# EasyEDA schematic BIT 5.json
TITLE: TRICORE | ALU | LOGIC; REV: 1.0; Date: 2022-01-06; Sheet: 7/9; Drawn By: Koehler, Paul; Company: komed3
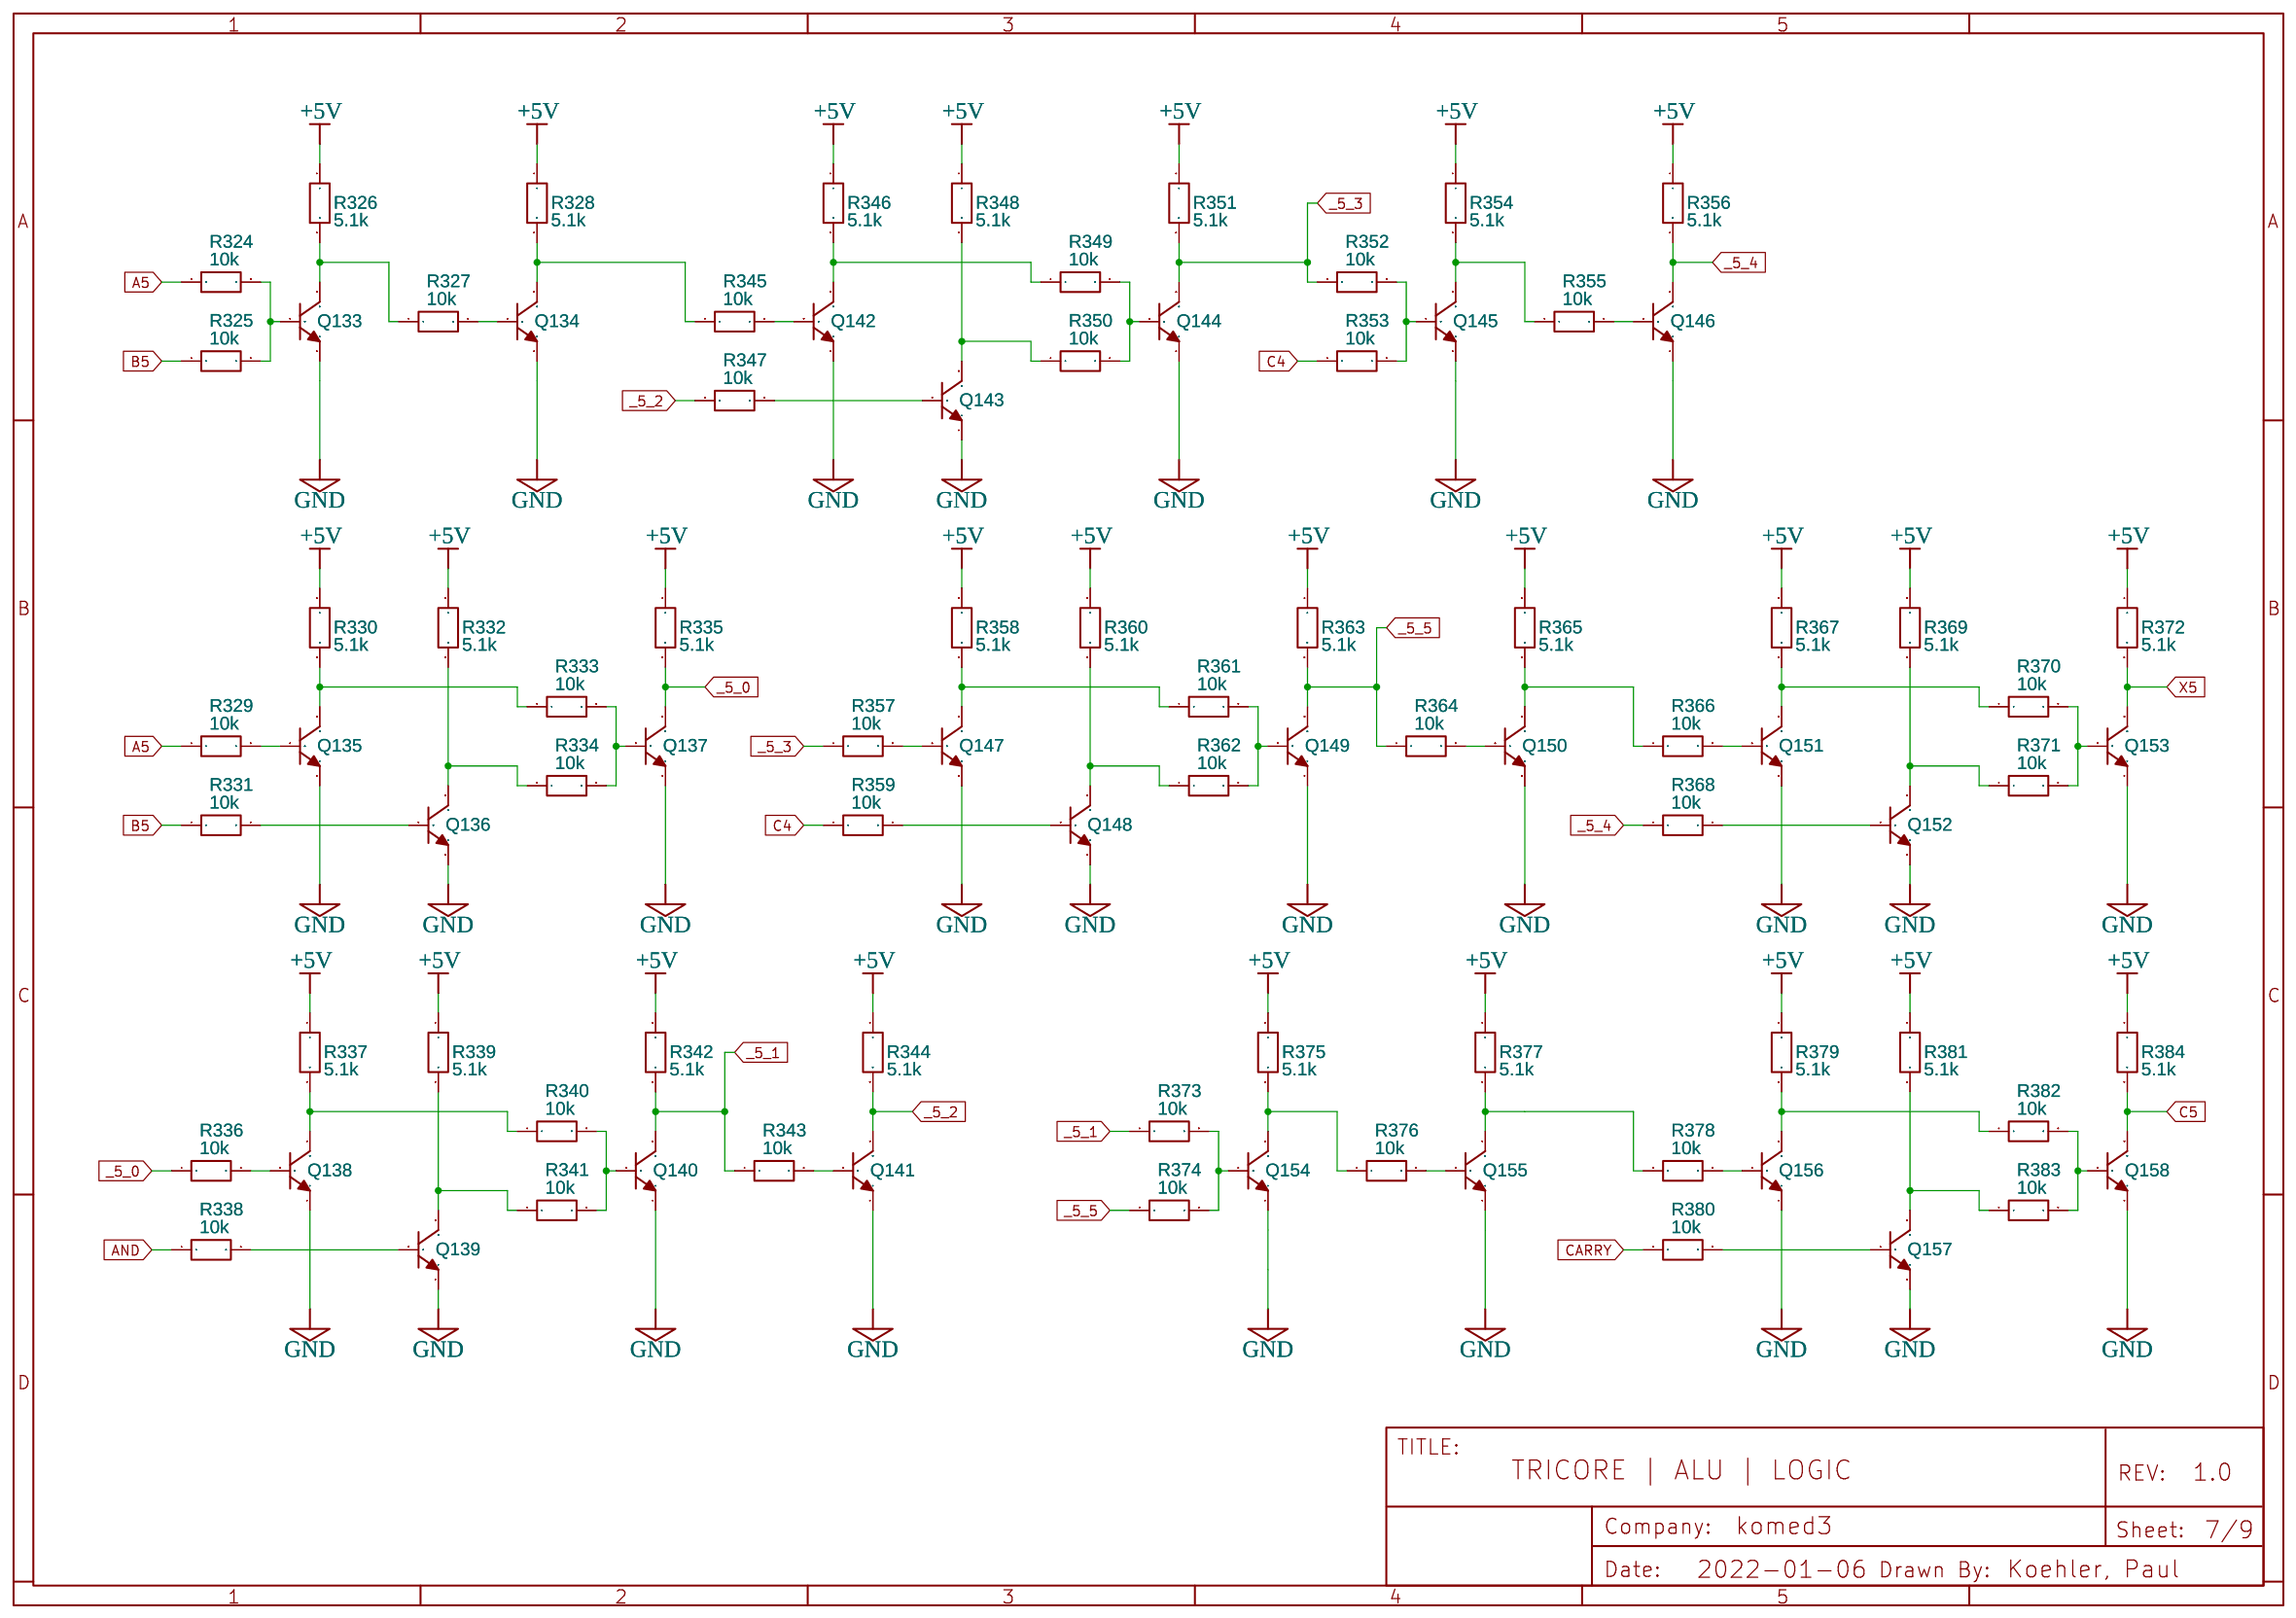
[diagram p0: schematic sheet]

## Parts
Q133  2N3904(TO-92)  [TO-92-3_L5.1-W4.1-P1.27-L]
Q134  2N3904(TO-92)  [TO-92-3_L5.1-W4.1-P1.27-L]
Q135  2N3904(TO-92)  [TO-92-3_L5.1-W4.1-P1.27-L]
Q136  2N3904(TO-92)  [TO-92-3_L5.1-W4.1-P1.27-L]
Q137  2N3904(TO-92)  [TO-92-3_L5.1-W4.1-P1.27-L]
Q138  2N3904(TO-92)  [TO-92-3_L5.1-W4.1-P1.27-L]
Q139  2N3904(TO-92)  [TO-92-3_L5.1-W4.1-P1.27-L]
Q140  2N3904(TO-92)  [TO-92-3_L5.1-W4.1-P1.27-L]
Q141  2N3904(TO-92)  [TO-92-3_L5.1-W4.1-P1.27-L]
Q142  2N3904(TO-92)  [TO-92-3_L5.1-W4.1-P1.27-L]
Q143  2N3904(TO-92)  [TO-92-3_L5.1-W4.1-P1.27-L]
Q144  2N3904(TO-92)  [TO-92-3_L5.1-W4.1-P1.27-L]
Q145  2N3904(TO-92)  [TO-92-3_L5.1-W4.1-P1.27-L]
Q146  2N3904(TO-92)  [TO-92-3_L5.1-W4.1-P1.27-L]
Q147  2N3904(TO-92)  [TO-92-3_L5.1-W4.1-P1.27-L]
Q148  2N3904(TO-92)  [TO-92-3_L5.1-W4.1-P1.27-L]
Q149  2N3904(TO-92)  [TO-92-3_L5.1-W4.1-P1.27-L]
Q150  2N3904(TO-92)  [TO-92-3_L5.1-W4.1-P1.27-L]
Q151  2N3904(TO-92)  [TO-92-3_L5.1-W4.1-P1.27-L]
Q152  2N3904(TO-92)  [TO-92-3_L5.1-W4.1-P1.27-L]
Q153  2N3904(TO-92)  [TO-92-3_L5.1-W4.1-P1.27-L]
Q154  2N3904(TO-92)  [TO-92-3_L5.1-W4.1-P1.27-L]
Q155  2N3904(TO-92)  [TO-92-3_L5.1-W4.1-P1.27-L]
Q156  2N3904(TO-92)  [TO-92-3_L5.1-W4.1-P1.27-L]
Q157  2N3904(TO-92)  [TO-92-3_L5.1-W4.1-P1.27-L]
Q158  2N3904(TO-92)  [TO-92-3_L5.1-W4.1-P1.27-L]
R324  10k  [0.25W-RESISTOR-VERTICAL]
R325  10k  [0.25W-RESISTOR-VERTICAL]
R326  5.1k  [0.25W-RESISTOR-VERTICAL]
R327  10k  [0.25W-RESISTOR-VERTICAL]
R328  5.1k  [0.25W-RESISTOR-VERTICAL]
R329  10k  [0.25W-RESISTOR-VERTICAL]
R330  5.1k  [0.25W-RESISTOR-VERTICAL]
R331  10k  [0.25W-RESISTOR-VERTICAL]
R332  5.1k  [0.25W-RESISTOR-VERTICAL]
R333  10k  [0.25W-RESISTOR-VERTICAL]
R334  10k  [0.25W-RESISTOR-VERTICAL]
R335  5.1k  [0.25W-RESISTOR-VERTICAL]
R336  10k  [0.25W-RESISTOR-VERTICAL]
R337  5.1k  [0.25W-RESISTOR-VERTICAL]
R338  10k  [0.25W-RESISTOR-VERTICAL]
R339  5.1k  [0.25W-RESISTOR-VERTICAL]
R340  10k  [0.25W-RESISTOR-VERTICAL]
R341  10k  [0.25W-RESISTOR-VERTICAL]
R342  5.1k  [0.25W-RESISTOR-VERTICAL]
R343  10k  [0.25W-RESISTOR-VERTICAL]
R344  5.1k  [0.25W-RESISTOR-VERTICAL]
R345  10k  [0.25W-RESISTOR-VERTICAL]
R346  5.1k  [0.25W-RESISTOR-VERTICAL]
R347  10k  [0.25W-RESISTOR-VERTICAL]
R348  5.1k  [0.25W-RESISTOR-VERTICAL]
R349  10k  [0.25W-RESISTOR-VERTICAL]
R350  10k  [0.25W-RESISTOR-VERTICAL]
R351  5.1k  [0.25W-RESISTOR-VERTICAL]
R352  10k  [0.25W-RESISTOR-VERTICAL]
R353  10k  [0.25W-RESISTOR-VERTICAL]
R354  5.1k  [0.25W-RESISTOR-VERTICAL]
R355  10k  [0.25W-RESISTOR-VERTICAL]
R356  5.1k  [0.25W-RESISTOR-VERTICAL]
R357  10k  [0.25W-RESISTOR-VERTICAL]
R358  5.1k  [0.25W-RESISTOR-VERTICAL]
R359  10k  [0.25W-RESISTOR-VERTICAL]
R360  5.1k  [0.25W-RESISTOR-VERTICAL]
R361  10k  [0.25W-RESISTOR-VERTICAL]
R362  10k  [0.25W-RESISTOR-VERTICAL]
R363  5.1k  [0.25W-RESISTOR-VERTICAL]
R364  10k  [0.25W-RESISTOR-VERTICAL]
R365  5.1k  [0.25W-RESISTOR-VERTICAL]
R366  10k  [0.25W-RESISTOR-VERTICAL]
R367  5.1k  [0.25W-RESISTOR-VERTICAL]
R368  10k  [0.25W-RESISTOR-VERTICAL]
R369  5.1k  [0.25W-RESISTOR-VERTICAL]
R370  10k  [0.25W-RESISTOR-VERTICAL]
R371  10k  [0.25W-RESISTOR-VERTICAL]
R372  5.1k  [0.25W-RESISTOR-VERTICAL]
R373  10k  [0.25W-RESISTOR-VERTICAL]
R374  10k  [0.25W-RESISTOR-VERTICAL]
R375  5.1k  [0.25W-RESISTOR-VERTICAL]
R376  10k  [0.25W-RESISTOR-VERTICAL]
R377  5.1k  [0.25W-RESISTOR-VERTICAL]
R378  10k  [0.25W-RESISTOR-VERTICAL]
R379  5.1k  [0.25W-RESISTOR-VERTICAL]
R380  10k  [0.25W-RESISTOR-VERTICAL]
R381  5.1k  [0.25W-RESISTOR-VERTICAL]
R382  10k  [0.25W-RESISTOR-VERTICAL]
R383  10k  [0.25W-RESISTOR-VERTICAL]
R384  5.1k  [0.25W-RESISTOR-VERTICAL]

## Library data of the parts
Q133-Q158 = 2N3904(TO-92): Supplier: LCSC; Manufacturer: SEMTECH; Manufacturer Part: 2N3904; Supplier Part: C118538; Contributor: LCEDA_Lib
R324-R384 = R_AXIAL-0.3_EU: Contributor: LCEDA_Lib

## Nets
+5V: R326.1 R328.1 R330.1 R332.1 R335.1 R337.1 R339.1 R342.1 R344.1 R346.1 R348.1 R351.1 R354.1 R356.1 R358.1 R360.1 R363.1 R365.1 R367.1 R369.1 R372.1 R375.1 R377.1 R379.1 R381.1 R384.1
GND: Q133.1(E) Q134.1(E) Q135.1(E) Q136.1(E) Q137.1(E) Q138.1(E) Q139.1(E) Q140.1(E) Q141.1(E) Q142.1(E) Q143.1(E) Q144.1(E) Q145.1(E) Q146.1(E) Q147.1(E) Q148.1(E) Q149.1(E) Q150.1(E) Q151.1(E) Q152.1(E) Q153.1(E) Q154.1(E) Q155.1(E) Q156.1(E) Q157.1(E) Q158.1(E)
_5_0: Q137.3(C) R335.2 R336.1
_5_1: Q140.3(C) R342.2 R343.1 R373.1
_5_2: Q141.3(C) R344.2 R347.1
_5_3: Q144.3(C) R351.2 R352.1 R357.1
_5_4: Q146.3(C) R356.2 R368.1
_5_5: Q149.3(C) R363.2 R364.1 R374.1
A5: R324.1 R329.1
AND: R338.1
B5: R325.1 R331.1
C4: R353.1 R359.1
C5: Q158.3(C) R384.2
CARRY: R380.1
X5: Q153.3(C) R372.2
Net-(Q133-2): Q133.2(B) R324.2 R325.2
Net-(Q133-3): Q133.3(C) R326.2 R327.1
Net-(Q134-2): Q134.2(B) R327.2
Net-(Q134-3): Q134.3(C) R328.2 R345.1
Net-(Q135-2): Q135.2(B) R329.2
Net-(Q135-3): Q135.3(C) R330.2 R333.1
Net-(Q136-2): Q136.2(B) R331.2
Net-(Q136-3): Q136.3(C) R332.2 R334.1
Net-(Q137-2): Q137.2(B) R333.2 R334.2
Net-(Q138-2): Q138.2(B) R336.2
Net-(Q138-3): Q138.3(C) R337.2 R340.1
Net-(Q139-2): Q139.2(B) R338.2
Net-(Q139-3): Q139.3(C) R339.2 R341.1
Net-(Q140-2): Q140.2(B) R340.2 R341.2
Net-(Q141-2): Q141.2(B) R343.2
Net-(Q142-2): Q142.2(B) R345.2
Net-(Q142-3): Q142.3(C) R346.2 R349.1
Net-(Q143-2): Q143.2(B) R347.2
Net-(Q143-3): Q143.3(C) R348.2 R350.1
Net-(Q144-2): Q144.2(B) R349.2 R350.2
Net-(Q145-2): Q145.2(B) R352.2 R353.2
Net-(Q145-3): Q145.3(C) R354.2 R355.1
Net-(Q146-2): Q146.2(B) R355.2
Net-(Q147-2): Q147.2(B) R357.2
Net-(Q147-3): Q147.3(C) R358.2 R361.1
Net-(Q148-2): Q148.2(B) R359.2
Net-(Q148-3): Q148.3(C) R360.2 R362.1
Net-(Q149-2): Q149.2(B) R361.2 R362.2
Net-(Q150-2): Q150.2(B) R364.2
Net-(Q150-3): Q150.3(C) R365.2 R366.1
Net-(Q151-2): Q151.2(B) R366.2
Net-(Q151-3): Q151.3(C) R367.2 R370.1
Net-(Q152-2): Q152.2(B) R368.2
Net-(Q152-3): Q152.3(C) R369.2 R371.1
Net-(Q153-2): Q153.2(B) R370.2 R371.2
Net-(Q154-2): Q154.2(B) R373.2 R374.2
Net-(Q154-3): Q154.3(C) R375.2 R376.1
Net-(Q155-2): Q155.2(B) R376.2
Net-(Q155-3): Q155.3(C) R377.2 R378.1
Net-(Q156-2): Q156.2(B) R378.2
Net-(Q156-3): Q156.3(C) R379.2 R382.1
Net-(Q157-2): Q157.2(B) R380.2
Net-(Q157-3): Q157.3(C) R381.2 R383.1
Net-(Q158-2): Q158.2(B) R382.2 R383.2
